# EAGLE design LilyTiny (EAGLE 6.5.0)
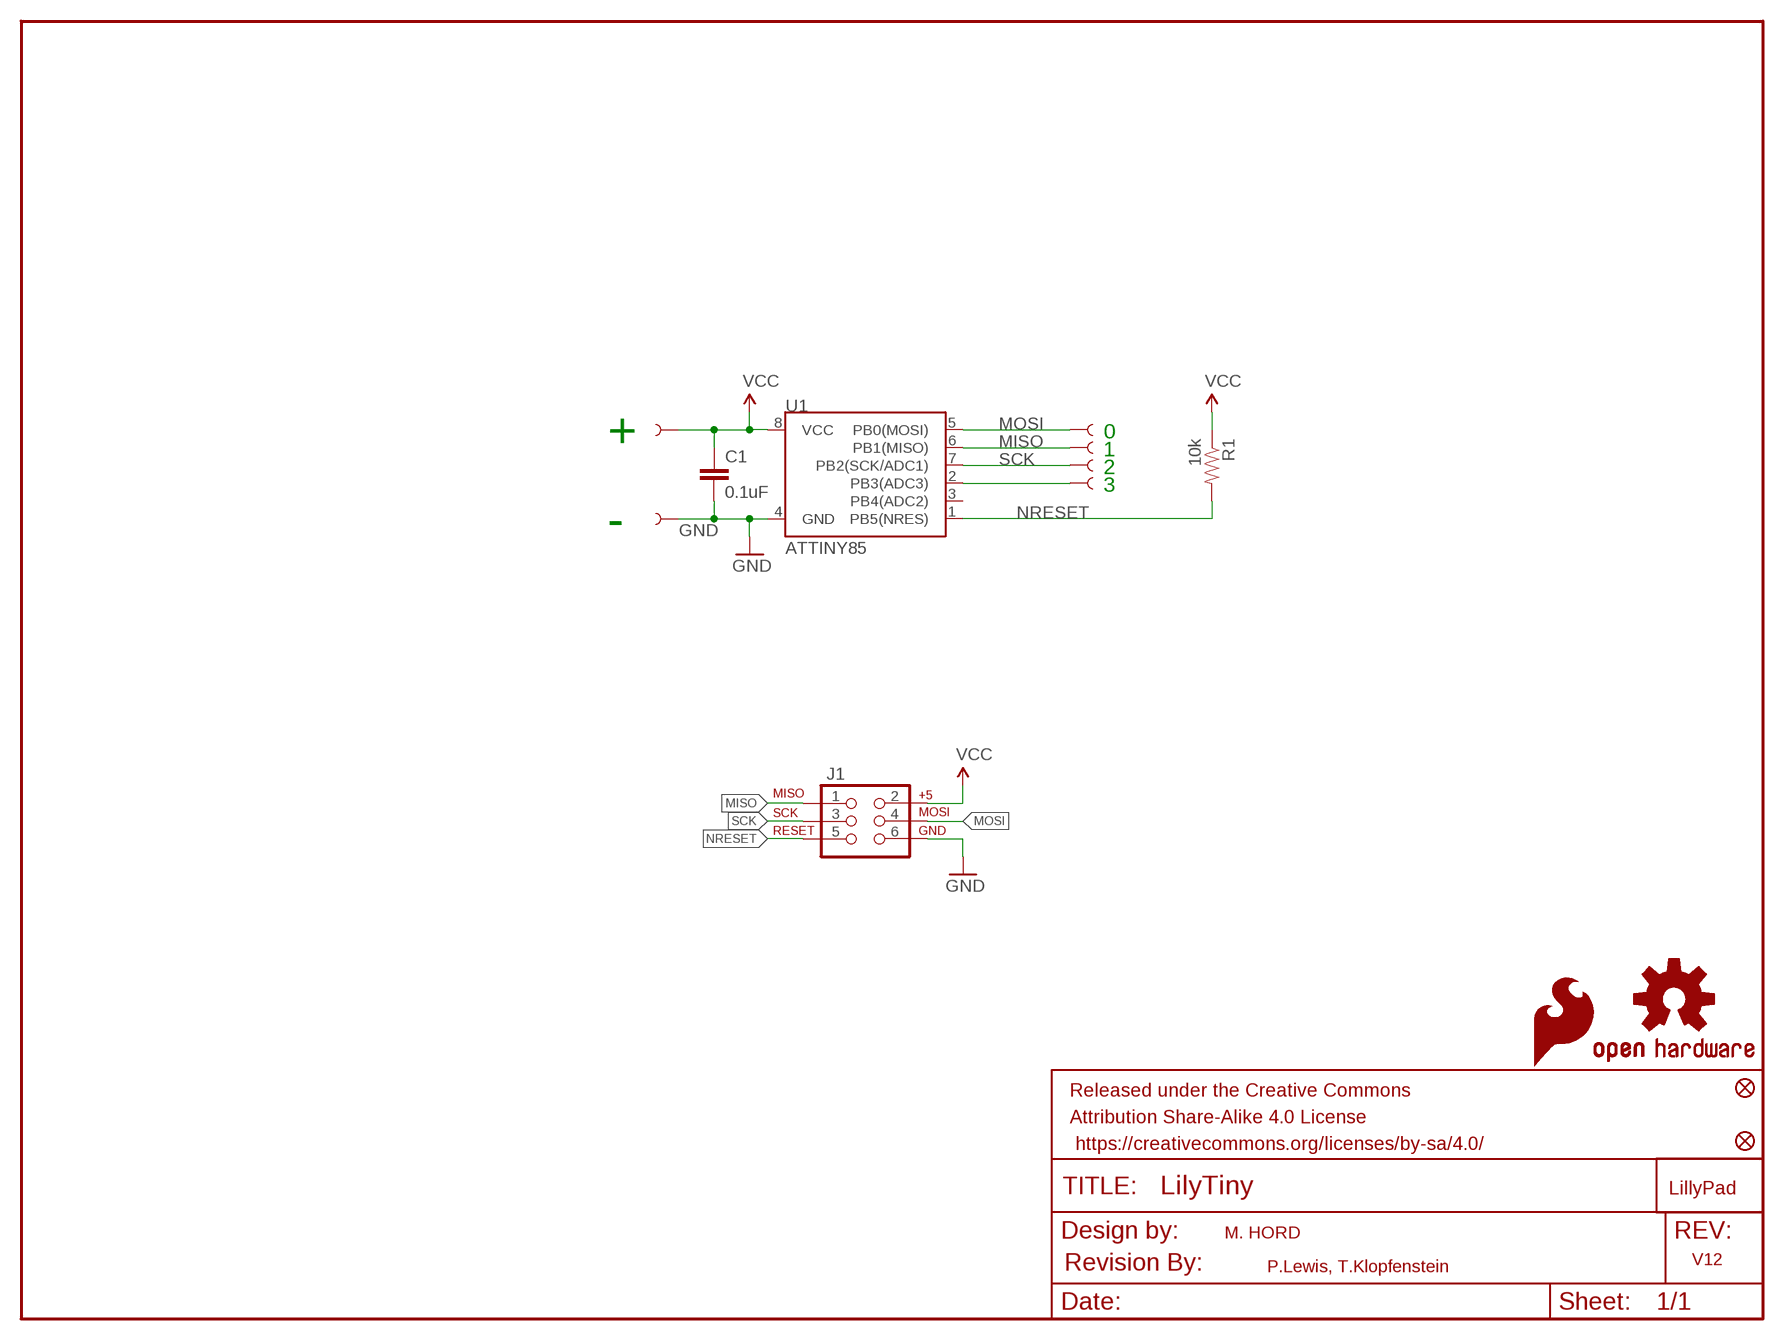
[diagram p0: schematic, sheet 1]

## Parts
C1  0.1uF  CAP0603-CAP  [0603-CAP]
FID1  FIDUCIAL1X2  [FIDUCIAL-1X2]
FID2  FIDUCIAL1X2  [FIDUCIAL-1X2]
FRAME2  FRAME-LETTER  [CREATIVE_COMMONS]
J1  AVR_SPI_PRG_6TESTPOINTS  [2X3_TEST_POINTS]
LOGO1  OSHW-LOGOS  [OSHW-LOGO-S]
LOGO2  SFE_LOGO_FLAME.1_INCH  [SFE_LOGO_FLAME_.1]
R1  10k  RESISTOR0603-RES  [0603-RES]
U1  ATTINY85  ATTINY45  [SO08-EIAJ]
U$1  REVISION  [REVISION]
U$2  SEWTAP6  [PETAL-SMALL-2SIDE]
U$3  SEWTAP6  [PETAL-SMALL-2SIDE]
U$4  SEWTAP6  [PETAL-SMALL-2SIDE]
U$5  SEWTAP6  [PETAL-SMALL-2SIDE]
U$6  SEWTAP6  [PETAL-SMALL-2SIDE]
U$7  SEWTAP6  [PETAL-SMALL-2SIDE]
U$8  LOGO-LPL  [LOGO-L]

## Nets
GND: C1.2 J1.6 U1.4(GND) U$2.1
MISO: J1.1 U1.6(PB1(MISO)) U$3.1
MOSI: J1.4 U1.5(PB0(MOSI)) U$7.1
N$6: U1.2(PB3(ADC3)) U$6.1
NRESET: J1.5 R1.2 U1.1(PB5(NRES))
SCK: J1.3 U1.7(PB2(SCK/ADC1)) U$4.1
VCC: C1.1 J1.2 R1.1 U1.8(VCC) U$5.1
Unconnected: U1.3(PB4(ADC2))

## Notes on the sheet
- 0
- +
- 1
- 2
- 3
- -
- M. HORD
- V12
- P.Lewis, T.Klopfenstein

## Library data of the parts
C1 = SparkFun:CAP: Capacitor Standard 0603 ceramic capacitor, and 0.1" leaded capacitor.
FID1 FID2 = SparkFun-Aesthetics:FIDUCIAL: Fiducial Alignment Points Various fiducial points for machine vision alignment.
FRAME2 = SparkFun-Aesthetics:FRAME-LETTER: Schematic Frame Standard 8.5x11 US Letter frame
J1 = SparkFun-Connectors:AVR_SPI_PRG_6: AVR ISP 6 Pin This is the reduced ISP connector for AVR programming. Common on Arduino. This footprint will take up less PCB space and can be used with a 10-pin to 6-pin adapter such as SKU: BOB-08508 **Special note about "TEST_POINT" package. The stop mask is on the top side, so if you want your programming test points to be on the bottom of your board, make sure to place this package on the bottom side of the board. This also ensure that the orientation to program from the bottom side will be correct.
LOGO1 = SparkFun-Aesthetics:OSHW-LOGO: Open Source Hardware Logo This logo indicates the piece of hardware it is found on incorporates a OSHW license and/or adheres to the definition of open source hardware found here: http://freedomdefined.org/OSHW
LOGO2 = SparkFun-Aesthetics:SFE_LOGO_FLAME: SFE Logo, flame only This is the SparkFun flame logo. The logo on the schematic will always be the same size; the package variant is the height of the flame. Default layer for the logo on the board is tSilk.
R1 = SparkFun:RESISTOR: Resistor Basic schematic elements and footprints for 0603, 1206, and PTH resistors.
U1 = SparkFun:ATTINY45: Atmel ATTiny45
U$1 = SparkFun-Aesthetics:REVISION
U$2-U$7 = LilyPad-Wearables:SEWTAP
U$8 = LilyPad-Wearables:LOGO-LP

## Board
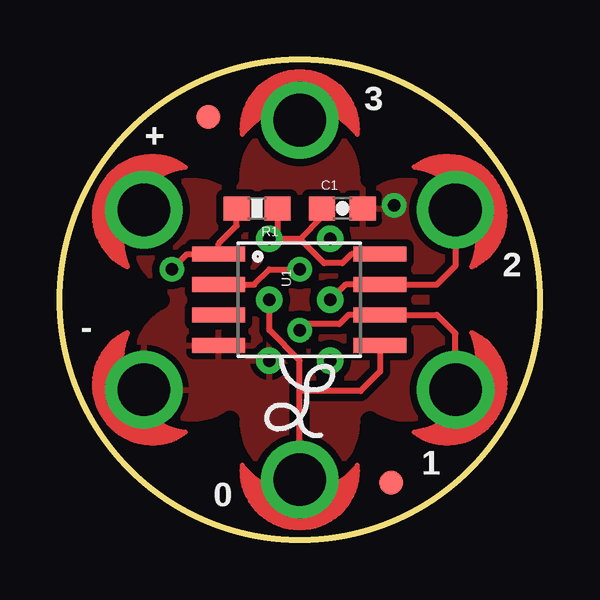
[diagram p1: board, top side]
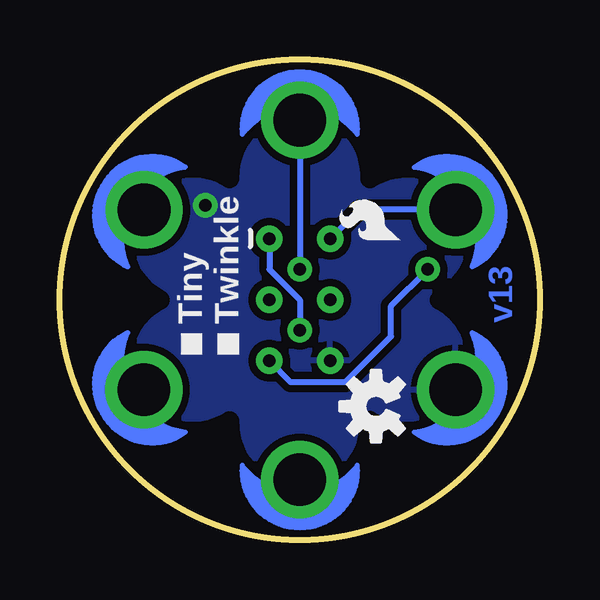
[diagram p2: board, bottom side, seen from below]

Size 20 x 20 mm. Coordinates in mm from the lower left corner, seen from the top.
Outline: circle at 10,10 radius 10
Copper layers (1*16): Top 0.035mm / dielectric 1.5mm / Bottom 0.035mm
Design rules "SparkFun-2-layer": minimum track width 7mil, minimum drill 15mil, track to track 8mil, track to pad 8mil, pad to pad 8mil, via to via 8mil, smd to smd 8mil, copper to edge 8mil, drill to drill 8mil, minimum pad ring 12mil, minimum via ring 10mil, stop-mask expansion 4mil, vias tented up to drill 20mil, thermal gap 10mil
tRestrict: area -1,10 to 10,21; area 10,10 to 21,21; area 10,-1 to 21,10; area -1,-1 to 10,10; 6 lines
bRestrict: area -1,10 to 10,21; area 10,10 to 21,21; area 10,-1 to 21,10; area -1,-1 to 10,10; 6 lines

### Footprints (pad centres in the part's own frame; a part is rotated, then mirrored left to right if it is on the bottom)
0603-CAP = smd 1.1 x 1: 1 -0.85,0; 2 0.85,0
FIDUCIAL-1X2 = smd 1 x 1: 1 0,0
2X3_TEST_POINTS = drill 0.508: 1 -2.54,-1.27; 2 -2.54,1.27; 3 0,-1.27; 4 0,1.27; 5 2.54,-1.27; 6 2.54,1.27
0603-RES = smd 1.1 x 1: 1 -0.85,0; 2 0.85,0
SO08-EIAJ = smd 0.61 x 2.21: 1 -1.905,-3.378; 2 -0.635,-3.378; 3 0.635,-3.378; 4 1.905,-3.378; 5 1.905,3.353; 6 0.635,3.353; 7 -0.635,3.353; 8 -1.905,3.353
PETAL-SMALL-2SIDE = drill 2.2: 1 0,0

### Placement (x,y rotation side)
C1  11.78,13.81 0 top
FID1  6.19,17.62 0 top
FID2  13.81,2.38 0 top
FRAME2  -16.67,-10.32 0 top  (outside the outline)
J1  10,10 270 bottom
LOGO1  6.83,5.55 90 bottom
LOGO2  5.46,12.18 90 bottom
R1  8.22,13.81 180 top
U1  10,10 270 top
U$1  -5.24,-12.86 0 top  (outside the outline)
U$2  3.5,6.25 300 top
U$3  16.5,6.25 60 top
U$4  16.49,13.75 120 top
U$5  3.5,13.75 240 top
U$6  10,17.49 180 top
U$7  10,2.5 0 top
U$8  10,5.94 0 top

### Tracks (layer width: path | path; a pad name or v marks a point on that pad's centre or on a via)
GND  (via drill 0.51)
  other vias: 13.94,13.94
  pour Bottom (isolate 0.305): 1.11,18.89 1.11,1.11 18.89,1.11 18.89,18.89
  pour Top (isolate 0.305): 1.11,18.89 1.11,1.11 18.89,1.11 18.89,18.89
MISO  (via drill 0.51)
  Top 0.254: U$3.1 16.5,8.58 15.71,9.37 U1.6 12.03,9.37 11.65,8.98 10.25,8.98 v10,8.73
  Bottom 0.254: U$3.1 16.29,6.25 | J1.1 11.27,11.27 10,10 v10,8.73
MOSI
  Top 0.254: J1.4 8.73,8.73 10,7.46 10,6.19 | U$7.1 10,6.19 | U1.5 13.35,7 12.54,6.19 10,6.19
N$6  (via drill 0.51)
  Top 0.254: U1.2 8.1,10.63 8.73,11.27 v10,11.27
  Bottom 0.254: U$6.1 v10,11.27
NRESET  (via drill 0.51)
  Top 0.254: v4.67,11.27 5.3,11.9 U1.1 6.62,12.34 7.37,13.09 R1.2
  Bottom 0.254: v4.67,11.27 6.19,9.75 6.19,8.48 8.1,6.57 10.38,6.57 J1.5
SCK
  Top 0.254: J1.3 11.9,10.63 U1.7 15.71,10.63 16.49,11.41 U$4.1
VCC
  Top 0.254: 10,12.54 J1.2 9.07,12.88 R1.1 | U1.8 12.16,11.9 11.78,11.52 11.02,11.52 10,12.54 | 10,12.54 10.93,13.47 C1.1
  Bottom 0.254: U$5.1 7.52,13.75 J1.2

### Text on the board
Bottom: v13
tPlace: 3 | + | 2 | - | 1 | 0
bPlace: Twinkle | Tiny
tDocu: M. HORD | P. Lewis, T. Klopfenstein